# EAGLE design microwave (EAGLE 6.6.0)
AUTHOR: YIFAN HAO; REV: A; TITLE: Microwave_Radar

## Sheet 1 of 3
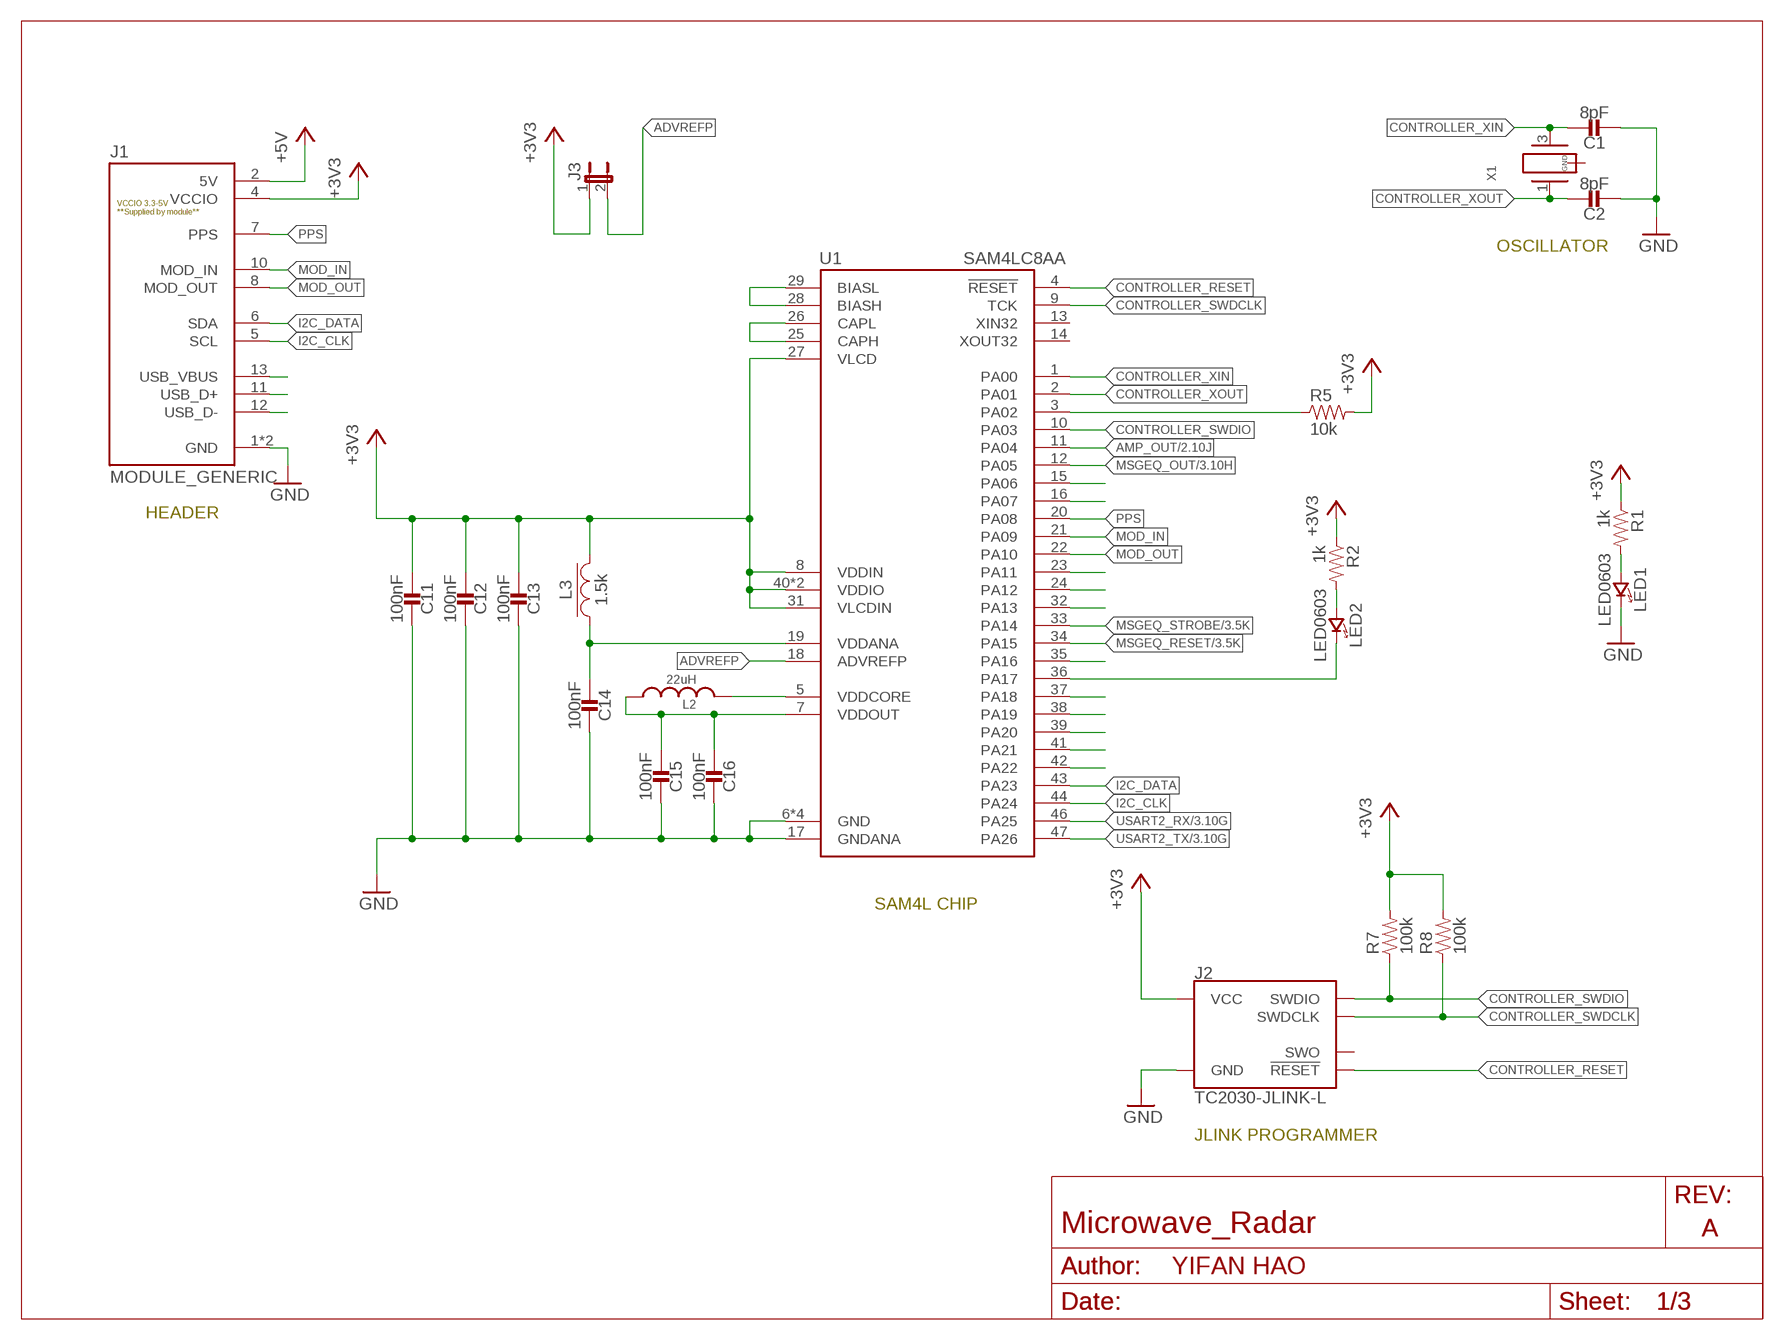
[diagram p0: schematic, sheet 1]
FRAME2 (LETTER_L_BLANK): AUTHOR: Yifan Hao; TITLE: Microwave_Radar

### Parts
C1  8pF  CAPACITOR0402_CAP  [0402_CAP]
C2  8pF  CAPACITOR0402_CAP  [0402_CAP]
C11  100nF  CAPACITOR0402_CAP  [0402_CAP]
C12  100nF  CAPACITOR0402_CAP  [0402_CAP]
C13  100nF  CAPACITOR0402_CAP  [0402_CAP]
C14  100nF  CAPACITOR0402_CAP  [0402_CAP]
C15  100nF  CAPACITOR0402_CAP  [0402_CAP]
C16  100nF  CAPACITOR0402_CAP  [0402_CAP]
J1  MODULE_GENERIC  [MODULE_GENERIC]
J2  TC2030-JLINK-L  [TC2030-IDC]
J3  JUMPER-2PTH  [1X02]
L2  22uH  LHQ3NP  [1212]
L3  1.5k  FERRITE_BEAD0402  [0402_CAP]
LED1  LED0603  [LED-0603]
LED2  LED0603  [LED-0603]
R1  1k  RESISTOR0402_RES  [0402_RES]
R2  1k  RESISTOR0402_RES  [0402_RES]
R5  10k  RESISTOR0402_RES  [0402_RES]
R7  100k  RESISTOR0402_RES  [0402_RES]
R8  100k  RESISTOR0402_RES  [0402_RES]
U1  SAM4LC8AA  [QFN-48-7MM]
X1  FH1600015  [FHXXX]

### Nets
+3V3: C11.2 C12.2 C13.2 J1.4(VCCIO) J2.1(VCC) J3.1 L3.2 R1.1 R2.1 R5.2 R7.2 R8.2 U1.8(VDDIN) U1.27(VLCD) U1.31(VLCDIN) U1.40(VDDIO) U1.45(VDDIO) ; also sheet 2,3
+5V: J1.2(5V) ; also sheet 2,3
ADVREFP: J3.2 U1.18(ADVREFP)
AMP_OUT: U1.11(PA04) ; also sheet 2,3
CONTROLLER_RESET: J2.3(!RESET) U1.4(!RESET)
CONTROLLER_SWDCLK: J2.4(SWDCLK) R8.1 U1.9(TCK)
CONTROLLER_SWDIO: J2.2(SWDIO) R7.1 U1.10(PA03)
CONTROLLER_XIN: C1.1 U1.1(PA00) X1.3
CONTROLLER_XOUT: C2.1 U1.2(PA01) X1.1
GND: C1.2 C2.2 C11.1 C12.1 C13.1 C14.1 C15.1 C16.1 J1.1(GND) J1.14(GND) J2.5(GND) LED1.C(CATHODE) U1.6(GND) U1.17(GNDANA) U1.30(GND) U1.48(GND) U1.THERMAL(GND) ; also sheet 2,3
I2C_CLK: J1.5(SCL) U1.44(PA24)
I2C_DATA: J1.6(SDA) U1.43(PA23)
MOD_IN: J1.10(MOD_IN) U1.21(PA09)
MOD_OUT: J1.8(MOD_OUT) U1.22(PA10)
MSGEQ_OUT: U1.12(PA05) ; also sheet 3
MSGEQ_RESET: U1.34(PA15) ; also sheet 3
MSGEQ_STROBE: U1.33(PA14) ; also sheet 3
N$4: LED1.A(ANODE) R1.2
N$5: L2.P$2 U1.5(VDDCORE)
N$6: C15.2 C16.2 L2.P$1 U1.7(VDDOUT)
N$10: U1.28(BIASH) U1.29(BIASL)
N$11: U1.25(CAPH) U1.26(CAPL)
N$13: C14.2 L3.1 U1.19(VDDANA)
N$14: R5.1 U1.3(PA02)
N$16: U1.15(PA06)
N$21: U1.16(PA07)
N$22: U1.23(PA11)
N$25: U1.24(PA12)
N$26: U1.32(PA13)
N$27: U1.35(PA16)
N$28: J1.13(USB_VBUS)
N$29: U1.37(PA18)
N$30: U1.38(PA19)
N$31: U1.39(PA20)
N$32: U1.41(PA21)
N$33: U1.42(PA22)
N$34: LED2.A(ANODE) R2.2
N$35: LED2.C(CATHODE) U1.36(PA17)
PPS: J1.7(PPS) U1.20(PA08)
USART2_RX: U1.46(PA25) ; also sheet 3
USART2_TX: U1.47(PA26) ; also sheet 3
USB+: J1.11(USB_D+)
USB-: J1.12(USB_D-)
Unconnected: J2.6(SWO) U1.13(XIN32) U1.14(XOUT32) X1.2(GND) X1.4(GND)

### Notes on the sheet
- OSCILLATOR
- HEADER
- SAM4L CHIP
- JLINK PROGRAMMER

## Sheet 2 of 3
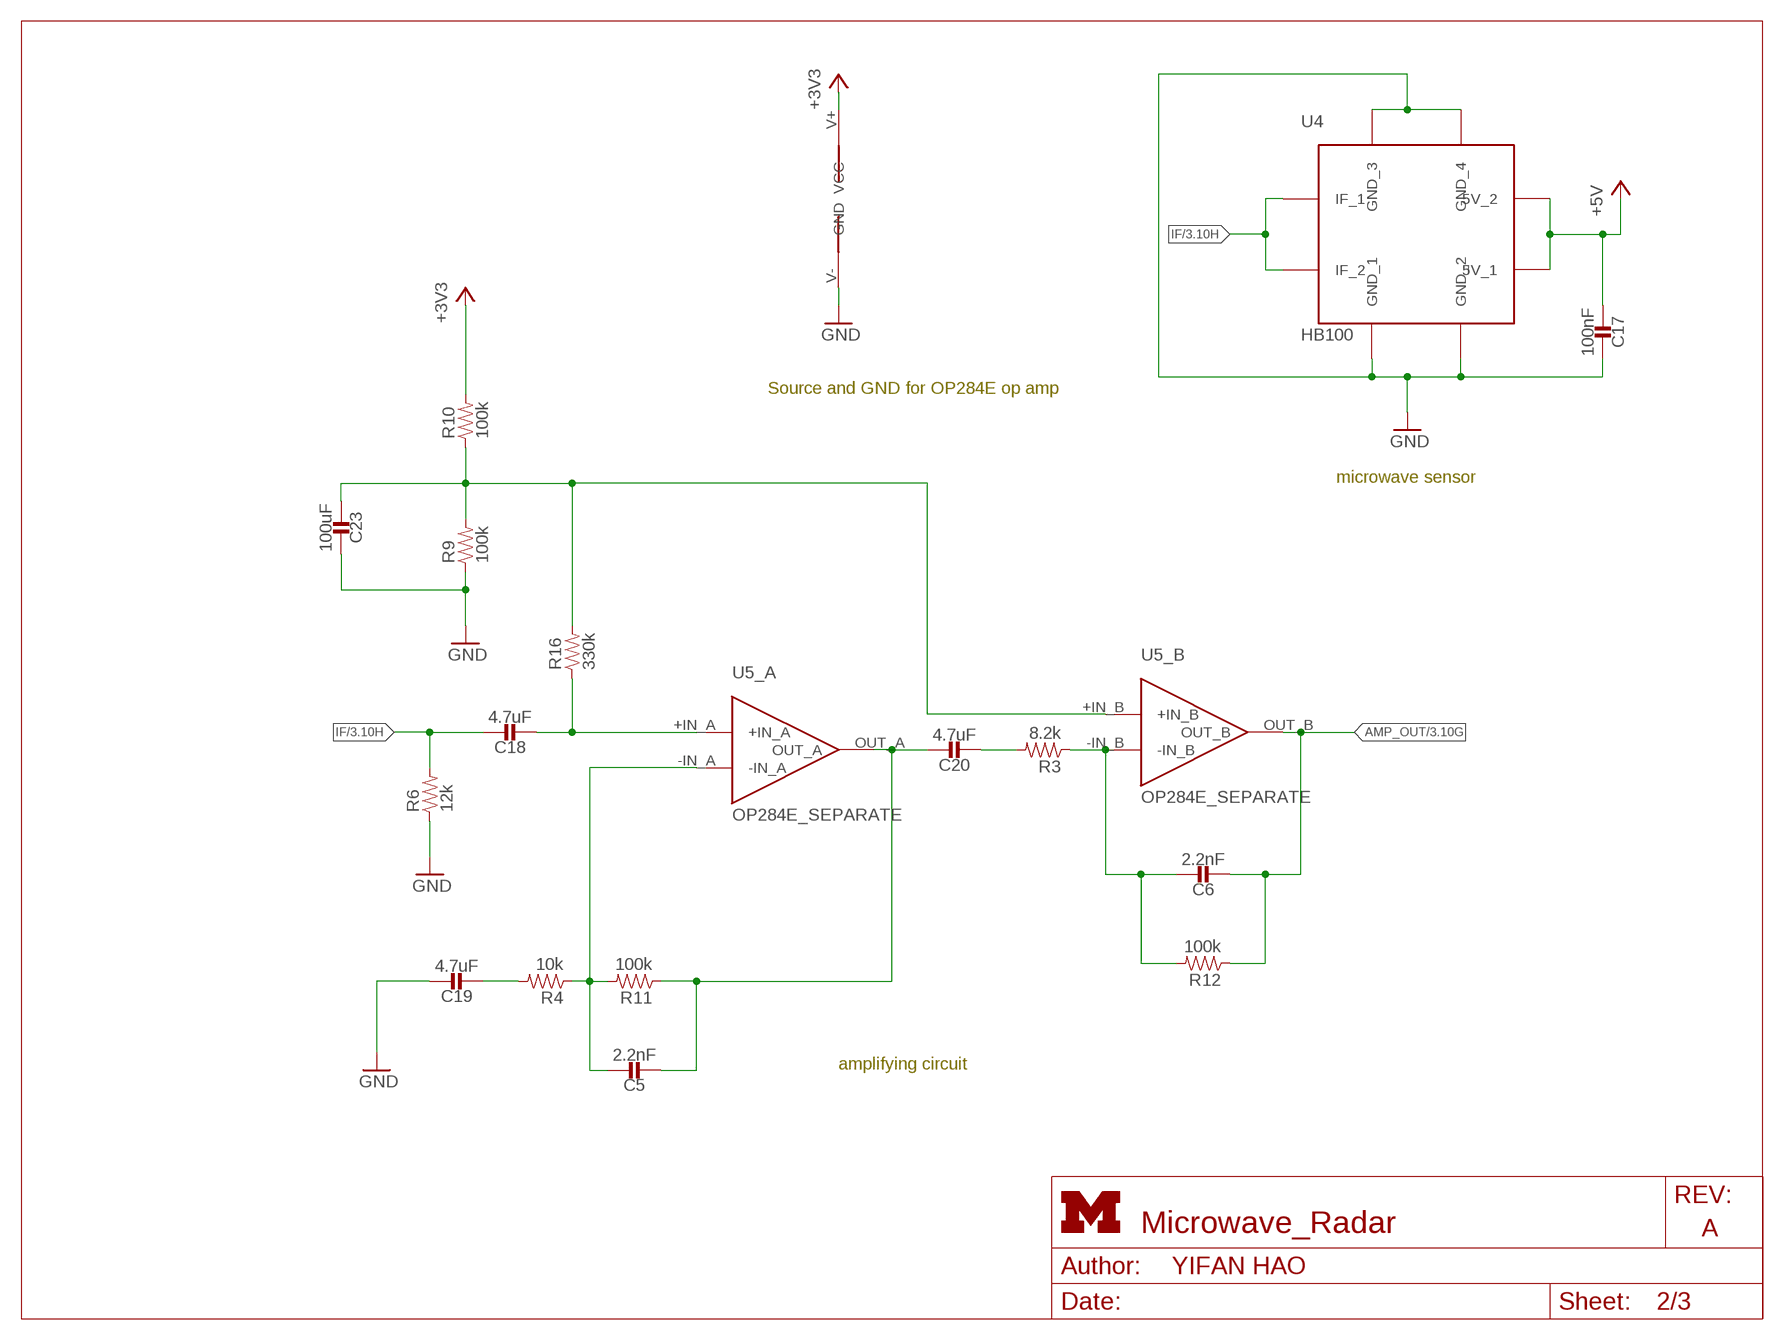
[diagram p1: schematic, sheet 2]
FRAME3 (LETTER_L_UMICH): HEIGHT: 8.5in; WIDTH: 11in

### Parts
C5  2.2nF  CAPACITOR0402_CAP  [0402_CAP]
C6  2.2nF  CAPACITOR0402_CAP  [0402_CAP]
C17  100nF  CAPACITOR0402_CAP  [0402_CAP]
C18  4.7uF  CAPACITOR0402_CAP  [0402_CAP]
C19  4.7uF  CAPACITOR0402_CAP  [0402_CAP]
C20  4.7uF  CAPACITOR0402_CAP  [0402_CAP]
C23  100uF  CAPACITOR1210_CAP  [1210_CAP]
R3  8.2k  RESISTOR0402_RES  [0402_RES]
R4  10k  RESISTOR0402_RES  [0402_RES]
R6  12k  RESISTOR0402_RES  [0402_RES]
R9  100k  RESISTOR0402_RES  [0402_RES]
R10  100k  RESISTOR0402_RES  [0402_RES]
R11  100k  RESISTOR0402_RES  [0402_RES]
R12  100k  RESISTOR0402_RES  [0402_RES]
R16  330k  RESISTOR0402_RES  [0402_RES]
U4  HB100  [HB100]
U5  OP284E_SEPARATE  [OP284E_SEPARATE]

### Nets
+3V3: R10.2 U5.V+(VCC) ; also sheet 1,3
+5V: C17.2 U4.5V_1 U4.5V_2 ; also sheet 1,3
AMP_OUT: C6.2 R12.1 U5.OUT_B(_B:OUT_B) ; also sheet 1,3
GND: C17.1 C19.1 C23.1 R6.1 R9.1 U4.GND_1 U4.GND_2 U4.GND_3 U4.GND_4 U5.V-(GND) ; also sheet 1,3
IF: C18.1 R6.2 U4.IF_1 U4.IF_2 ; also sheet 3
N$1: C23.2 R9.2 R10.1 R16.2 U5.+IN_B(_B:+IN_B)
N$9: C18.2 R16.1 U5.+IN_A(_A:+IN_A)
N$12: C5.1 R4.1 R11.2 U5.-IN_A(_A:-IN_A)
N$15: C19.2 R4.2
N$17: C5.2 C20.1 R11.1 U5.OUT_A(_A:OUT_A)
N$18: C20.2 R3.2
N$19: C6.1 R3.1 R12.2 U5.-IN_B(_B:-IN_B)

### Notes on the sheet
- Source and GND for OP284E op amp
- microwave sensor
- amplifying circuit

## Sheet 3 of 3
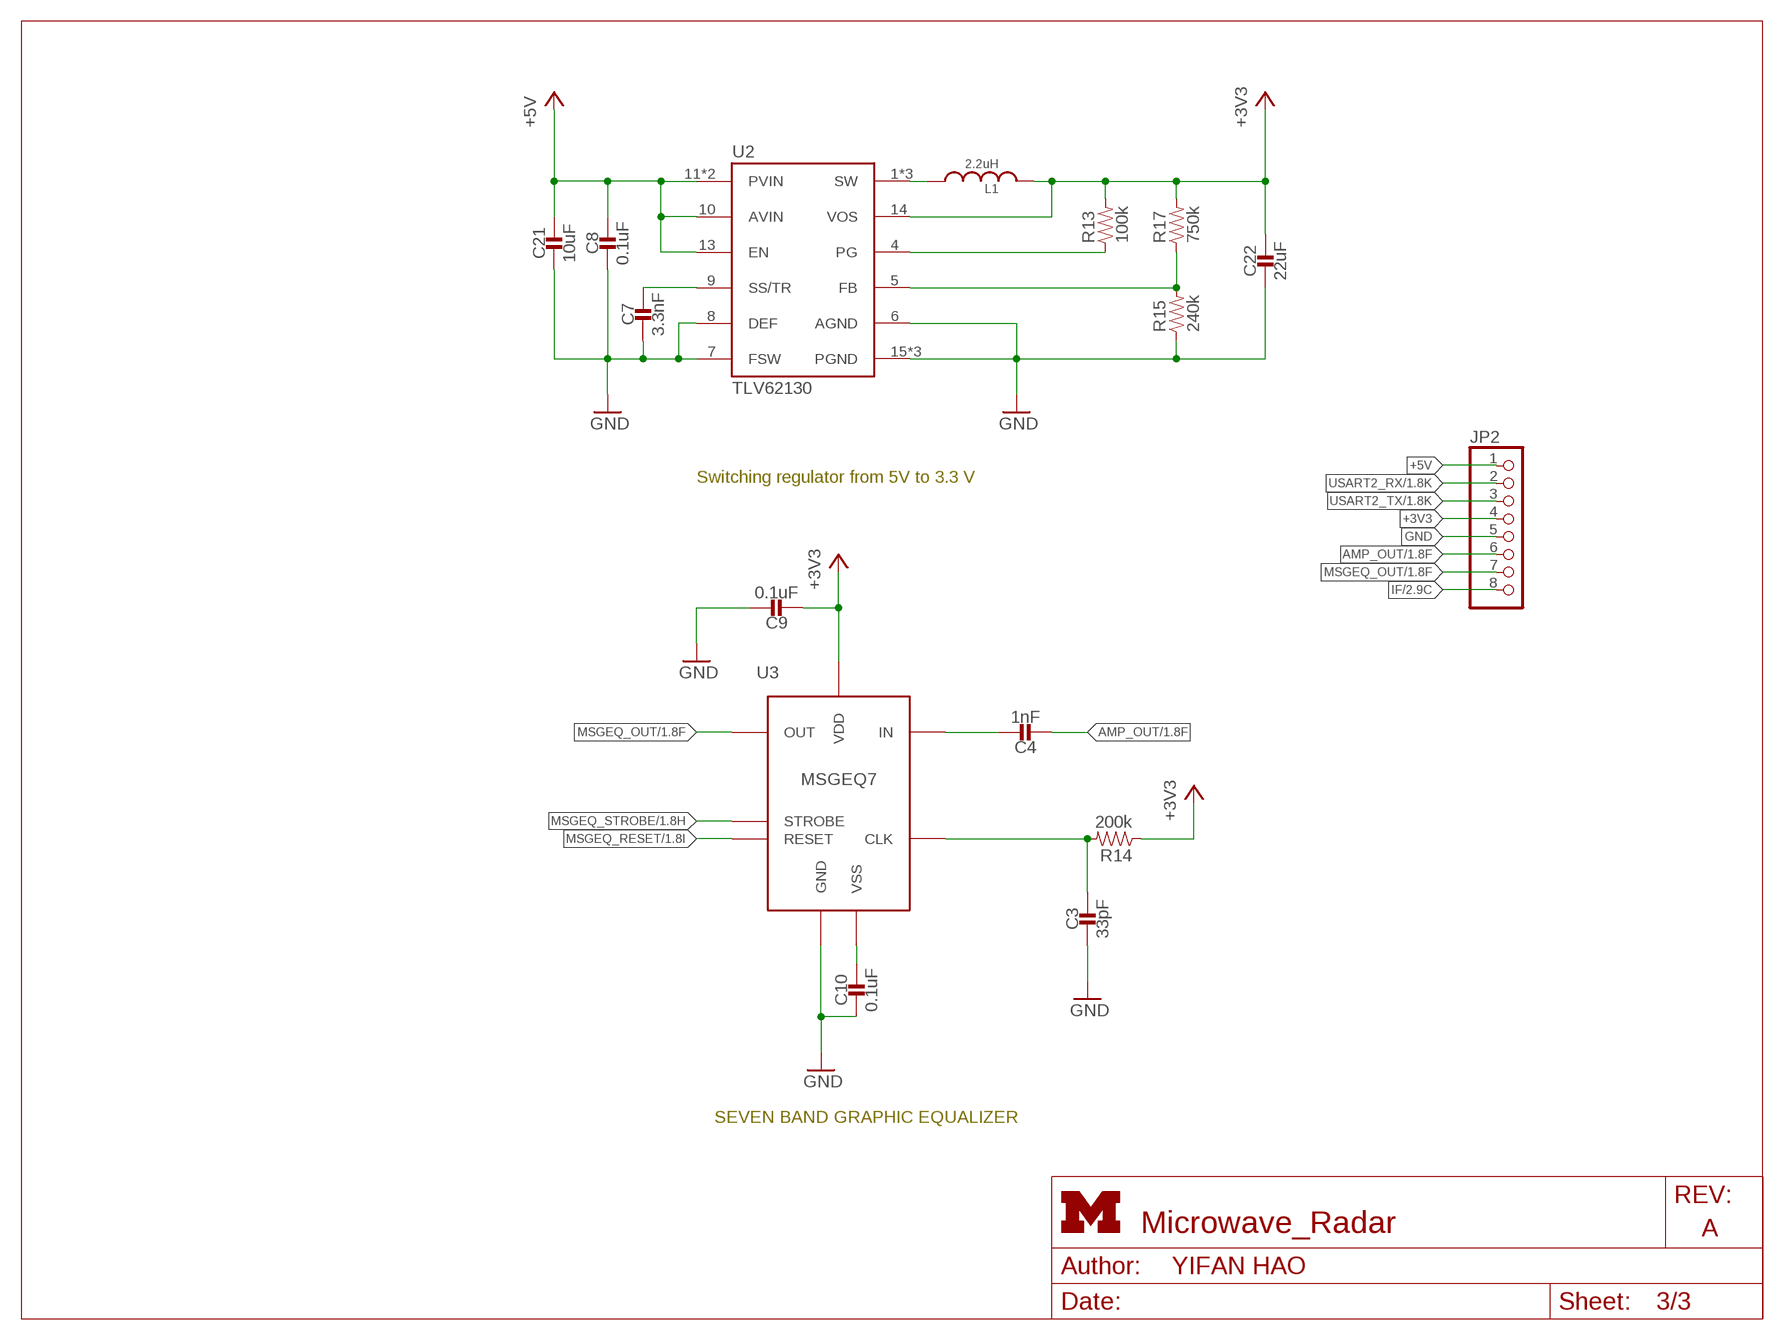
[diagram p2: schematic, sheet 3]
FRAME4 (LETTER_L_UMICH): HEIGHT: 8.5in; WIDTH: 11in

### Parts
C3  33pF  CAPACITOR0603_CAP  [0603_CAP]
C4  1nF  CAPACITOR0603_CAP  [0603_CAP]
C7  3.3nF  CAPACITOR0402_CAP  [0402_CAP]
C8  0.1uF  CAPACITOR0402_CAP  [0402_CAP]
C9  0.1uF  CAPACITOR0603_CAP  [0603_CAP]
C10  0.1uF  CAPACITOR0603_CAP  [0603_CAP]
C21  10uF  CAPACITOR0805_CAP  [0805_CAP]
C22  22uF  CAPACITOR0603_CAP  [0603_CAP]
JP2  PINHD-1X8  [1X08]
L1  2.2uH  INDUCTORIHL  [IHL-1212BZ-11]
R13  100k  RESISTOR0402_RES  [0402_RES]
R14  200k  RESISTOR0603_RES  [0603-RES]
R15  240k  RESISTOR0402_RES  [0402_RES]
R17  750k  RESISTOR0402_RES  [0402_RES]
U2  TLV62130  [TQFN-16/3MM]
U3  MSGEQ7  [DIP-8]

### Nets
+3V3: C9.2 C22.1 JP2.4 L1.P$2 R13.2 R14.1 R17.2 U2.14(VOS) U3.1(VDD) ; also sheet 1,2
+5V: C8.1 C21.P$1 JP2.1 U2.10(AVIN) U2.11(PVIN) U2.12(PVIN) U2.13(EN) ; also sheet 1,2
AMP_OUT: C4.2 JP2.6 ; also sheet 1,2
GND: C3.2 C7.2 C8.2 C9.1 C10.2 C21.P$2 C22.2 JP2.5 R15.1 U2.6(AGND) U2.7(FSW) U2.8(DEF) U2.15(PGND) U2.16(PGND) U2.GND U3.6(GND) ; also sheet 1,2
IF: JP2.8 ; also sheet 2
MSGEQ_OUT: JP2.7 U3.3(OUT) ; also sheet 1
MSGEQ_RESET: U3.7(RESET) ; also sheet 1
MSGEQ_STROBE: U3.4(STROBE) ; also sheet 1
N$2: C3.1 R14.2 U3.8(CLK)
N$3: C4.1 U3.5(IN)
N$7: C10.1 U3.2(VSS)
N$8: C7.1 U2.9(SS/TR)
N$20: L1.P$1 U2.1(SW) U2.2(SW) U2.3(SW)
N$23: R13.1 U2.4(PG)
N$24: R15.2 R17.1 U2.5(FB)
USART2_RX: JP2.2 ; also sheet 1
USART2_TX: JP2.3 ; also sheet 1

### Notes on the sheet
- Switching regulator from 5V to 3.3 V
- SEVEN BAND GRAPHIC EQUALIZER

## Library data of the parts
C1 C2 = passives:CAPACITOR: 0402 Capacitor; DIGIKEY: 490-8230-1-ND
C3 = passives:CAPACITOR: 0402 Capacitor; DIGIKEY: 490-1415-1-ND
C4 = passives:CAPACITOR: 0402 Capacitor; DIGIKEY: 490-1494-1-ND
C5 C6 = passives:CAPACITOR: 0402 Capacitor; DIGIKEY: 490-11418-1-ND
C7 = passives:CAPACITOR: 0402 Capacitor; DIGIKEY: 490-3248-1-ND
C8 = passives:CAPACITOR: 0402 Capacitor; DIGIKEY: 490-5920-1-ND
C9 C10 = passives:CAPACITOR: 0402 Capacitor; DIGIKEY: 490-1532-1-ND
C11-C14 C16 C17 = passives:CAPACITOR: 0402 Capacitor; DIGIKEY: 490-10777-1-ND
C15 = passives:CAPACITOR: 0402 Capacitor; DIGIKEY: 490-13252-1-ND
C18-C20 = passives:CAPACITOR: 0402 Capacitor; DIGIKEY: 1276-1481-1-ND
C21 = passives:CAPACITOR: 0402 Capacitor; DIGIKEY: 490-5523-1-ND
C22 = passives:CAPACITOR: 0402 Capacitor; DIGIKEY: 1276-1193-1-ND
C23 = passives:CAPACITOR: 0402 Capacitor; DIGIKEY: 490-3390-1-ND
J1 = signpost:MODULE_GENERIC: Module header and PCB guildes for signposts; DIGIKEY: S9170-ND
J2 = connector:TC2030-JLINK
J3 = umich:JUMPER-2: Jumper Basic 0.1" spaced jumper. Use with breakaway headers.
JP2 = pinhead:PINHD-1X8: PIN HEADER
L1 = passives:INDUCTOR: A very specific inductor; DIGIKEY: 541-1322-1-ND
L2 = signpost:LHQ3NP: LHQ3NP Inductor; DIGIKEY: 490-5350-1-ND
L3 = passives:FERRITE_BEAD; DIGIKEY: 490-5216-1-ND
LED1 LED2 = leds:LED: LED
R1 R2 = passives:RESISTOR: Resistor Basic schematic elements and footprints for 0603, 1206, and PTH resistors.; DIGIKEY: 1276-3430-1-ND
R3 = passives:RESISTOR: Resistor Basic schematic elements and footprints for 0603, 1206, and PTH resistors.; DIGIKEY: 311-8.20KLRCT-ND
R4 R5 = passives:RESISTOR: Resistor Basic schematic elements and footprints for 0603, 1206, and PTH resistors.; DIGIKEY: 1276-3431-1-ND
R6 = passives:RESISTOR: Resistor Basic schematic elements and footprints for 0603, 1206, and PTH resistors.; DIGIKEY: 1276-4122-1-ND
R7-R12 = passives:RESISTOR: Resistor Basic schematic elements and footprints for 0603, 1206, and PTH resistors.; DIGIKEY: 1276-3432-1-ND
R13 = passives:RESISTOR: Resistor Basic schematic elements and footprints for 0603, 1206, and PTH resistors.; DIGIKEY: P100KJCT-ND
R14 = passives:RESISTOR: Resistor Basic schematic elements and footprints for 0603, 1206, and PTH resistors.; DIGIKEY: RHM200KCFCT-ND
R15 = passives:RESISTOR: Resistor Basic schematic elements and footprints for 0603, 1206, and PTH resistors.; DIGIKEY: P240KLCT-ND
R16 = passives:RESISTOR: Resistor Basic schematic elements and footprints for 0603, 1206, and PTH resistors.; DIGIKEY: 1276-4244-1-ND
R17 = passives:RESISTOR: Resistor Basic schematic elements and footprints for 0603, 1206, and PTH resistors.; DIGIKEY: P750KLCT-ND
U1 = chips:SAM4LC8AA: Atmel SAM4L microcontroller. ARM Cortex M4 with 512 KB Flash and 64 KB RAM; DIGIKEY: ATSAM4LC8AA-MU-ND
U2 = chips:TLV62130: High Efficient 3A switching step-down regulator. 1V-5V out, 4V-17V in.; DIGIKEY: 296-35978-1-ND
U3 = chips:MSGEQ7: A CMOS spectrum analyzer; DIGIKEY: 1568-1335-ND
U4 = microwave_radar:HB100; DIGIKEY: SAM1067-02-ND
U5 = microwave_radar:OP284E_SEPARATE; DIGIKEY: OP284ESZ-ND
X1 = crystals:FH1600015: Pericom Type FH 16 MHz 2.5 x 2.0 mm; DIGIKEY: FH1600015CT-ND

## Board
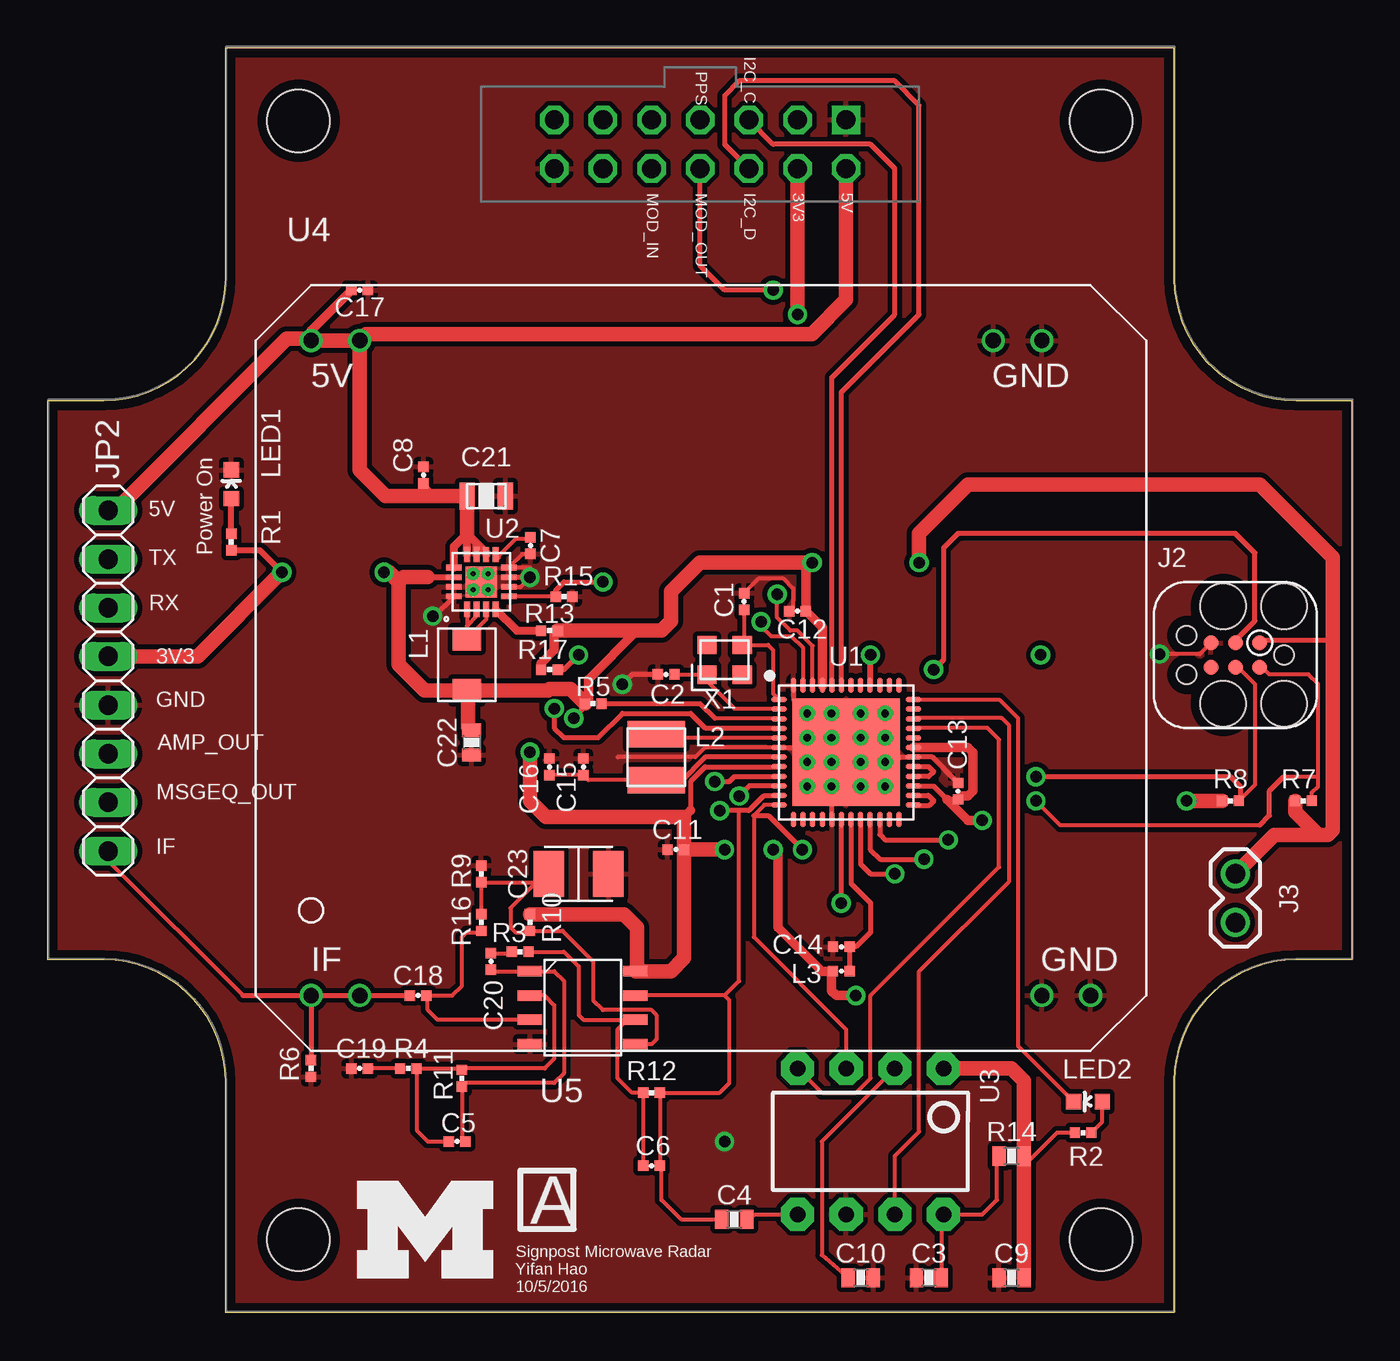
[diagram p3: board, top side]
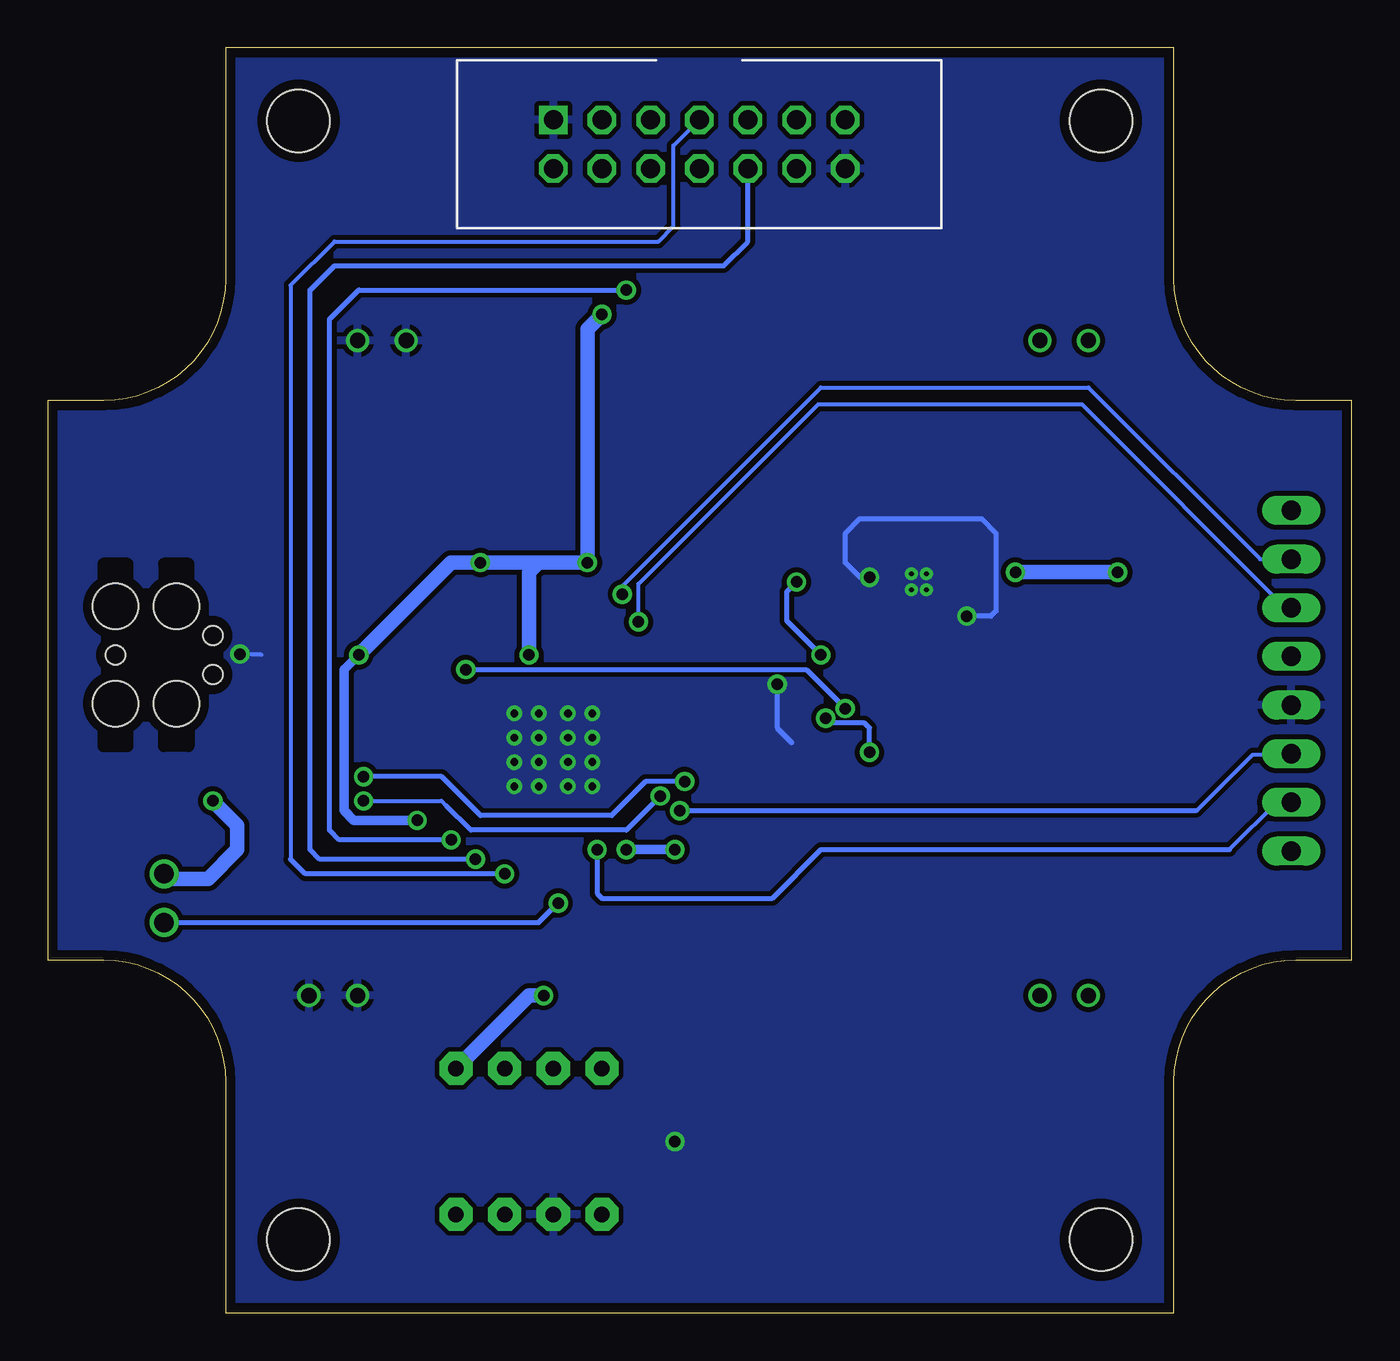
[diagram p4: board, bottom side, seen from below]

Size 68.07 x 66.04 mm. Coordinates in mm from the lower left corner, seen from the top.
Outline: 9.27,0 9.27,12.06 arc90 2.92,18.41 0,18.41 0,47.62 2.92,47.62 arc90 9.27,53.97 9.27,66.04 58.8,66.04 58.8,53.97 arc90 65.15,47.62 68.07,47.62 68.07,18.41 65.15,18.41 arc90 58.8,12.06 58.8,0 9.27,0
Copper layers (1*16): Top 0.0178mm / dielectric 59mil / Bottom 0.0178mm
Design rules "quickturn_co_kr_1oz": minimum track width 4mil, minimum drill 0.200659375mm, track to track 4mil, track to pad 4mil, pad to pad 4mil, via to via 4mil, smd to smd 4mil, copper to edge 20mil, drill to drill 16mil, minimum pad ring 8mil, minimum via ring 8mil, stop-mask expansion 3mil, vias tented up to drill 50mil, thermal gap 10mil
Holes 3.26 mm at 13.08,62.23 54.99,62.23 13.08,3.81 54.99,3.81

### Footprints (pad centres in the part's own frame; a part is rotated, then mirrored left to right if it is on the bottom)
0402_CAP = smd 0.536 x 0.546: 1 -0.433,0; 2 0.433,0
0603_CAP = smd 0.7 x 1: 1 -0.65,0; 2 0.65,0
0805_CAP = smd 0.8 x 1.4: P$1 1,0; P$2 -1,0
1210_CAP = smd 2.4 x 1.6: 1 0,1.55; 2 0,-1.55
MODULE_GENERIC = drill 0.991 square: 1 7.62,29.21 | drill 0.991 octagon: 2 7.62,26.67; 3 5.08,29.21; 4 5.08,26.67; 5 2.54,29.21; 6 2.54,26.67; 7 0,29.21; 8 0,26.67; 9 -2.54,29.21; 10 -2.54,26.67; 11 -5.08,29.21; 12 -5.08,26.67; 13 -7.62,29.21; 14 -7.62,26.67
TC2030-IDC = smd 0.787 x 0.787: 1 -1.27,-0.635; 2 -1.27,0.635; 3 0,-0.635; 4 0,0.635; 5 1.27,-0.635; 6 1.27,0.635 | hole 2.375: -2.54,2.54; 0.635,2.54; 0.635,-2.54; -2.54,-2.54 | hole 1.016: -2.54,0; 2.54,1.016; 2.54,-1.016
1X02 = drill 1.016: 1 0,0; 2 2.54,0
1X08 = drill 1.016 long: 1 -8.89,0; 2 -6.35,0; 3 -3.81,0; 4 -1.27,0; 5 1.27,0; 6 3.81,0; 7 6.35,0; 8 8.89,0
IHL-1212BZ-11 = smd 1.2 x 1.5: P$1 -1.35,0; P$2 1.35,0
1212 = smd 1.4 x 3: P$1 -1.2,0; P$2 1.2,0
LED-0603 = smd 0.8 x 0.8: A 0,-0.75; C 0,0.75
0402_RES = smd 0.536 x 0.546: 1 -0.433,0; 2 0.433,0
0603-RES = smd 0.7 x 1: 1 -0.65,0; 2 0.65,0
QFN-48-7MM = smd 0.8 x 0.28: 1 -3.5,2.75; 2 -3.5,2.25; 3 -3.5,1.75; 4 -3.5,1.25; 5 -3.5,0.75; 6 -3.5,0.25; 7 -3.5,-0.25; 8 -3.5,-0.75; 9 -3.5,-1.25; 10 -3.5,-1.75; 11 -3.5,-2.25; 12 -3.5,-2.75; 25 3.5,-2.75; 26 3.5,-2.25; 27 3.5,-1.75; 28 3.5,-1.25; 29 3.5,-0.75; 30 3.5,-0.25; 31 3.5,0.25; 32 3.5,0.75; 33 3.5,1.25; 34 3.5,1.75; 35 3.5,2.25; 36 3.5,2.75 | smd 0.28 x 0.8: 13 -2.75,-3.5; 14 -2.25,-3.5; 15 -1.75,-3.5; 16 -1.25,-3.5; 17 -0.75,-3.5; 18 -0.25,-3.5; 19 0.25,-3.5; 20 0.75,-3.5; 21 1.25,-3.5; 22 1.75,-3.5; 23 2.25,-3.5; 24 2.75,-3.5; 37 2.75,3.5; 38 2.25,3.5; 39 1.75,3.5; 40 1.25,3.5; 41 0.75,3.5; 42 0.25,3.5; 43 -0.25,3.5; 44 -0.75,3.5; 45 -1.25,3.5; 46 -1.75,3.5; 47 -2.25,3.5; 48 -2.75,3.5 | smd 5.6 x 5.6: THERMAL 0,0
TQFN-16/3MM = smd 0.3 x 0.8: 1 -0.75,-1.43; 2 -0.25,-1.43; 3 0.25,-1.43; 4 0.75,-1.43; 9 0.75,1.43; 10 0.25,1.43; 11 -0.25,1.43; 12 -0.75,1.43 | smd 0.8 x 0.3: 5 1.43,-0.75; 6 1.43,-0.25; 7 1.43,0.25; 8 1.43,0.75; 13 -1.43,0.75; 14 -1.43,0.25; 15 -1.43,-0.25; 16 -1.43,-0.75 | smd 1.63 x 1.63: GND 0,0
DIP-8 = drill 0.813 pad 1.727 octagon: 1 -3.81,-3.81; 2 -1.27,-3.81; 3 1.27,-3.81; 4 3.81,-3.81; 5 3.81,3.81; 6 1.27,3.81; 7 -1.27,3.81; 8 -3.81,3.81
HB100 = drill 0.8: 5V_1 0,34.2; 5V_2 2.54,34.2; GND_1 35.62,34.2; GND_2 38.16,34.2; GND_3 38.16,0; GND_4 40.7,0; IF_1 0,0; IF_2 2.54,0
OP284E_SEPARATE = smd 1.27 x 0.55: +IN_A 0,2.54; +IN_B 5.5,1.27; -IN_A 0,3.81; -IN_B 5.5,2.54; OUT_A 0,5.08; OUT_B 5.5,3.81; V+ 5.5,5.08; V- 0,1.27
FHXXX = smd 1 x 0.95: 1 -0.925,-0.775; 2 0.925,-0.775; 3 0.925,0.775; 4 -0.925,0.775

### Placement (x,y rotation side)
C1  36.35,37.13 90 top
C2  32.28,33.32 180 top
C3  46,1.83 180 top
C4  35.84,4.88 180 top
C5  21.36,8.94 0 top
C6  31.52,7.67 0 top
C7  25.2,40.06 270 top
C8  19.61,43.74 90 top
C9  50.32,1.83 0 top
C10  42.44,1.83 0 top
C11  32.79,24.18 0 top
C12  39.14,36.63 0 top
C13  47.52,27.23 270 top
C14  41.43,19.1 0 top
C15  27.97,28.5 270 top
C16  26.19,28.5 270 top
C17  16.28,53.39 180 top
C18  19.33,16.56 0 top
C19  16.28,12.75 0 top
C20  23.14,18.34 90 top
C21  22.89,42.65 180 top
C22  22.12,29.77 270 top
C23  27.71,22.91 270 top
J1  34.06,33.07 0 top
J2  62,34.34 180 top
J3  62,22.91 270 top
JP2  3.15,32.99 270 top
L1  21.87,33.83 270 top
L2  31.78,29.01 90 top
L3  41.43,17.83 180 top
LED1  9.58,43.26 0 top
LED2  54.31,11.02 90 top
R1  9.58,40.23 90 top
R2  54.05,9.4 0 top
R3  24.66,18.85 180 top
R4  18.82,12.75 180 top
R5  28.47,31.8 180 top
R6  13.74,12.75 90 top
R7  65.56,26.72 180 top
R8  61.75,26.72 180 top
R9  22.63,22.91 270 top
R10  25.17,20.37 90 top
R11  21.62,12.24 90 top
R12  31.52,11.48 180 top
R13  26.19,35.61 0 top
R14  50.32,8.18 180 top
R15  26.95,37.39 180 top
R16  22.63,20.37 90 top
R17  26.19,33.58 180 top
U1  41.68,29.26 0 top
U2  22.63,38.15 0 top
U3  42.95,8.94 180 top
U4  13.74,16.56 0 top
U5  25.17,12.75 0 top
U$1  [UMICH_SOLID_200MIL]  16.15,1.8 0 top
X1  35.33,34.09 0 top

### Tracks (layer width: path | path; a pad name or v marks a point on that pad's centre or on a via)
+3V3  (via drill 0.6)
  Top 0.203: 22.04,32.31 L1.P$2 | U2.14 | 30.76,17.92 U5.V+ | R2.1 52.69,9.4 50.97,7.67
  Top 0.254: v42.95,34.34 42.93,34.32 | R8.2 61.24,26.65 | 40.92,17.76 L3.2 | U1.8 38.17,28.5 34.32,28.5 33.55,27.74 33.55,26.21 | R7.2 65.12,26.03 | 67.08,35.1 63.4,35.1 J2.1 | 21.95,32.56 L1.P$2 | v27.46,31.04 28.04,31.62 R5.2 | U1.27 45.21,27.48 46.25,27.48 46.94,26.8 C13.2 47.7,26.97 | R13.2 26.44,35.43 | 25.75,33.91 R17.2
  Top 0.305: 19.84,38.4 U2.14 | 42.93,34.32 U1.40 | v12.22,38.66 11.08,39.8 R1.1
  Top 0.406: 27.97,31.88 R5.2 28.22,31.98
  Top 0.508: v39.9,39.17 39.57,38.84 C12.2 40.43,35.77 U1.45 | v42.19,16.56 41.17,16.56 40.92,16.81 40.92,17.76 | L3.2 40.41,17.83 38.13,20.12 38.13,23.93 v37.87,24.18 | 33.55,26.21 33.22,25.88 | v48.79,25.7 48.03,25.7 46.94,26.8 | U1.31 48.04,29.51 48.29,29.26 48.29,27.23 48.03,26.97 47.7,26.97 | 26.44,35.43 26.44,34.59 25.75,33.91 | 30.76,35.61 28.22,33.07 28.22,31.98
  Top 0.762: C11.2 33.22,18.52 32.54,17.83 U5.V+ | R10.2 30.07,20.8 30.76,20.12 30.76,17.92 | v39.9,39.17 34.06,39.17 32.54,37.64 32.54,36.12 32.03,35.61 30.76,35.61 R13.2 | U3.1 50.32,12.75 50.97,12.1 R14.1 50.97,7.67 C9.2 | v35.33,24.18 C11.2 | C11.2 33.22,25.88 26.01,25.88 25.17,26.72 v25.17,29.26 | v39.14,52.12 J1.4 | R7.2 65.12,26.14 66.32,24.94 | v45.49,39.17 45.49,40.69 48.03,43.23 63.27,43.23 67.08,39.42 67.08,35.1 67.08,25.2 66.83,24.94 66.32,24.94 | 66.32,24.94 64.03,24.94 J3.1 | R8.2 v59.46,26.72 | v17.55,38.66 17.81,38.66 18.31,38.15 | 18.31,38.15 18.31,33.83 19.66,32.48 L1.P$2 26.11,32.48 26.19,32.56 27.28,32.56 R5.2 | 19.84,38.4 18.57,38.4 18.31,38.15 | 21.95,32.56 21.95,30.59 C22.1 | JP2.4 7.82,34.26 v12.22,38.66
  Bottom 0.254: v25.17,29.26 25.17,30.53 25.43,30.78 27.2,30.78 v27.46,31.04 | 61.75,22.66 J3.1
  Bottom 0.508: v37.87,24.18 v35.33,24.18 | v48.79,25.7 52.1,25.7 52.6,26.21 52.6,33.58 v51.84,34.34
  Bottom 0.762: 42.44,39.17 v39.9,39.17 39.9,51.36 v39.14,52.12 | 42.44,39.17 42.95,38.66 v42.95,34.34 | U3.1 42.95,16.56 v42.19,16.56 | 42.44,39.17 v45.49,39.17 47.02,39.17 v51.84,34.34 | v12.22,38.66 v17.55,38.66 | v59.46,26.72 58.19,25.45 58.19,24.18 59.72,22.66 61.75,22.66
+5V
  Top 0.254: 16.63,51.1 U4.5V_2
  Top 0.406: U2.12 21.88,40.69 | U2.11 22.38,40.19 | 22.38,40.19 21.88,40.69 | U2.10 22.88,39.69 22.38,40.19 | U2.13 21.2,40.01 21.88,40.69 | C8.1 19.61,43.13 20.09,42.65 | C21.P$1 21.89,41.96 21.88,41.96
  Top 0.508: C17.2 13.74,51.28 U4.5V_1
  Top 0.762: 16.63,51.1 39.9,51.1 41.68,52.88 J1.2 | 21.88,40.69 21.88,41.96 C21.P$1 | JP2.1 3.51,41.88 12.47,50.85 13.65,50.85 U4.5V_1 U4.5V_2 16.28,43.99 17.63,42.65 20.09,42.65 C21.P$1
ADVREFP  (via drill 0.6)
  Top 0.254: v41.43,21.39 U1.18
  Bottom 0.254: J3.2 42.44,20.37 v41.43,21.39
AMP_OUT  (via drill 0.6)
  Top 0.203: 35.33,16.56 36.09,17.32 36.09,26.21 | 38.15,26.97 U1.11 | 35.33,16.56 35.59,16.31 35.59,11.99 35.08,11.48 R12.1 C6.2 32.03,7.6 32.03,5.89 33.05,4.88 C4.2 | 35.33,16.56 U5.OUT_B
  Top 0.254: v35.08,26.21 36.09,26.21 36.6,26.21 37.36,26.97 38.15,26.97
  Bottom 0.203: 8.15,26.21 8.08,26.21 5.16,29.13 3.2,29.13 JP2.6
  Bottom 0.254: v35.08,26.21 8.15,26.21
CONTROLLER_RESET  (via drill 0.6)
  Top 0.254: J2.3 62,35.1 63.02,36.12 63.02,39.67 62,40.69 47.52,40.69 46.76,39.93 46.76,34.09 v46.25,33.58 | v26.44,31.55 26.44,30.53 26.95,30.02 28.73,30.02 30,31.29 33.55,31.29 34.32,30.53 38.16,30.53 U1.4
  Bottom 0.254: v46.25,33.58 28.47,33.58 v26.44,31.55
CONTROLLER_SWDCLK  (via drill 0.6)
  Top 0.203: J2.4 62.13,33.71 63.02,32.82 63.02,27.56 R8.1
  Top 0.254: 62,26.72 R8.1 62.26,26.8 62.26,27.48 61.75,27.99 v51.59,27.99 | v34.82,27.74 35.59,27.74 35.84,27.99 38.16,27.99 U1.9
  Bottom 0.254: 51.33,27.74 v51.59,27.99 47.52,27.99 45.49,25.96 38.63,25.96 36.86,27.74 v34.82,27.74
CONTROLLER_SWDIO  (via drill 0.6)
  Top 0.203: J2.2 63.27,33.58 63.53,33.58 63.78,33.32 65.81,33.32 66.32,32.82 66.32,27.99 | 63.27,25.45 52.86,25.45 v51.59,26.72 | R7.1 65.99,27.15 66.32,27.48 66.32,27.99 | 64.54,27.99 66.32,27.99
  Top 0.254: U1.10 36.63,27.51 v36.09,26.97 | 63.27,25.45 63.78,25.96 63.78,27.23 64.54,27.99 | 66.07,26.8 R7.1
  Bottom 0.203: v51.59,26.72 47.52,26.72 47.27,26.47
  Bottom 0.254: v36.09,26.97 37.87,25.2 46,25.2 47.27,26.47
CONTROLLER_XIN
  Top 0.203: U1.1 37.87,32.32 37.87,34.59 37.6,34.86 X1.3 36.35,34.95 C1.1
CONTROLLER_XOUT
  Top 0.203: C2.1 34.39,33.32 X1.1 34.41,32.98 35.84,31.55 38.15,31.55 U1.2
GND  (via drill 0.25, 0.41, 0.6)
  Top 0.203: U1.30 | U1.6 34.31,29.51 33.81,29.01 29.74,29.01 | U2.6 24.67,37.9 v25.17,38.4 | U2.7 24.66,38.4 25.17,38.91 24.07,38.91 U2.8 24.78,39.62 C7.2 | J2.5 60.15,34.39 v58.04,34.39 | 38.76,36.68 C12.1 38.91,36.83 38.91,37.82 38.38,38.35 37.13,38.35 C1.2
  Top 0.254: U1.17 v40.93,27.47 v40.92,27.48 | U1.48 38.93,32.01 v39.65,31.29 | C2.2 30.51,33.32 v30,32.82 | U2.7 v25.17,38.4 | v20.09,36.37 20.17,36.37 U2.16 | v40.92,28.75 41.17,28.75 U1.THERMAL | v43.71,28.75 44.22,28.75 44.48,29.01 U1.30 46.17,29.01 C13.1 | U1.6 38.89,29.51 39.14,29.26 | v39.65,28.75 v39.65,27.48
  Bottom 0.203: v58.04,34.39 56.97,34.39 56.92,34.34
  Bottom 0.254: v30,32.82 30,30.53 29.24,29.77 | v25.17,38.4 25.68,38.4 26.44,39.17 26.44,40.69 25.68,41.45 19.33,41.45 18.57,40.69 18.57,36.63 18.82,36.37 v20.09,36.37
  other vias: 39.65,30.02 40.92,31.29 40.92,30.02 42.44,31.29 43.71,31.29 42.44,30.02 43.71,30.02 43.71,27.48 42.44,27.48 42.44,28.75 22.2,37.74 22.2,38.58 22.99,38.58 22.99,37.74 35.33,8.94
  pour Top (isolate 0.254): -4.04,71.17 -4.04,-7.57 74.7,-7.57 74.7,72.44 -4.04,72.44
  pour Bottom (isolate 0.254): -7.85,73.71 -7.85,-10.11 78.51,-10.11 78.51,74.98 -7.85,74.98
I2C_CLK
  Top 0.254: U1.44 40.93,48.83 44.22,52.12 44.22,59.74 42.95,61.01 37.87,61.01 J1.5
I2C_DATA
  Top 0.254: U1.43 41.43,48.06 45.49,52.12 45.49,63.04 44.22,64.31 36.09,64.31 35.33,63.55 35.33,61.01 J1.6
IF
  Top 0.203: JP2.8 3.15,23.6 10.19,16.56
  Top 0.254: 10.19,16.56 U4.IF_1 | U4.IF_1 R6.2 | U4.IF_1 U4.IF_2 C18.1
MOD_IN  (via drill 0.6)
  Top 0.254: U1.21 42.93,24.2 43.46,23.67 v45.75,23.67
  Bottom 0.254: v45.75,23.67 53.87,23.67 54.38,24.18 54.38,53.39 53.11,54.66 32.79,54.66 31.52,55.93 J1.10
MOD_OUT  (via drill 0.6)
  Top 0.254: U1.22 43.43,24.97 43.71,24.69 v47.02,24.69 | v37.87,53.39 35.33,53.39 34.06,54.66 J1.8
  Bottom 0.254: v47.02,24.69 52.86,24.69 53.37,25.2 53.37,51.87 51.84,53.39 v37.87,53.39
MSGEQ_OUT  (via drill 0.6)
  Top 0.203: U1.12 37.41,26.51 36.86,25.96 36.86,19.61 41.68,14.78 U3.3
  Top 0.254: 36.86,25.96 37.62,25.96 v39.4,24.18
  Bottom 0.203: JP2.7 3.91,26.64 6.38,24.18
  Bottom 0.254: v39.4,24.18 39.4,21.89 39.14,21.64 30.25,21.64 27.71,24.18 6.38,24.18
MSGEQ_RESET
  Top 0.203: U3.7 44.22,8.18 45.49,9.45 45.49,17.83 50.19,22.53 50.19,30.66 49.81,31.04 45.21,31.04 U1.34
MSGEQ_STROBE
  Top 0.203: U3.4 40.41,11.48 42.19,11.48 42.95,12.24 42.95,16.56 49.66,23.27 49.66,29.92 49.05,30.53 45.2,30.53 U1.33
N$1
  Top 0.203: R16.2 R9.2 25.73,22.48 C23.2 25.93,22.91 24.16,21.13 24.16,20.12 24.41,19.86 25.1,19.86 R10.1 26.87,19.94 28.47,18.34 28.47,16.31 28.98,15.8 31.52,15.8 31.78,15.54 31.78,14.27 31.52,14.02 U5.+IN_B
N$2
  Top 0.203: R14.2 49.56,8.09 49.56,5.89 48.79,5.13 U3.8 46.85,5.04 46.65,4.84 C3.1
N$3
  Top 0.203: C4.1 36.94,5.13 U3.5
N$4
  Top 0.305: R1.2 LED1.A
N$5
  Top 0.203: U1.5 32.55,30.01 32.54,30.02 31.96,30.02 L2.P$2
N$6
  Top 0.203: U1.7 | L2.P$1 28.22,27.81 C15.2 C16.2
  Top 0.254: U1.7 34.32,29.01 33.05,27.74 31.85,27.74 L2.P$1
N$7
  Top 0.203: U3.2 40.41,8.94 40.41,3.01 C10.1
N$8
  Top 0.203: U2.9 23.54,39.42 23.54,39.52 24.43,40.41 25.12,40.41 C7.1
N$9
  Top 0.203: R16.1 22.56,19.86 21.87,19.86 21.62,19.61 21.62,17.07 21.11,16.56 C18.2 19.84,16.49 19.84,15.8 20.35,15.29 U5.+IN_A
N$10
  Top 0.254: U1.29 45.99,28.51 46.25,28.24 46,27.99 45.2,27.99 U1.28
N$11
  Top 0.254: U1.26 45.96,27.01 46.25,26.72 46,26.47 45.23,26.47 U1.25
N$12
  Top 0.203: C5.1 19.84,8.94 19.25,9.52 R4.1 21.54,12.75 R11.2 21.69,12.75 25.93,12.75 26.44,13.26 26.44,16.05 25.93,16.56 U5.-IN_A
N$13
  Top 0.254: U1.19 41.93,22.41 42.95,21.39 42.95,19.86 42.19,19.1 C14.2 L3.1
N$14
  Top 0.203: 34.82,31.04 38.15,31.04 U1.3
  Top 0.254: R5.1 34.06,31.8 34.82,31.04
N$15
  Top 0.203: R4.2 C19.2
N$17
  Top 0.203: C5.2 21.62,9.12 R11.1 21.79,11.99 26.44,11.99 26.95,12.5 26.95,17.32 26.44,17.83 U5.OUT_A 23.21,17.83 C20.1
N$18
  Top 0.203: C20.2 24.16,18.77 R3.2
N$19
  Top 0.203: R3.1 26.95,18.85 27.71,18.08 27.71,15.54 27.97,15.29 30.25,15.29 | C6.1 R12.2 30.51,11.48 29.74,12.24 29.74,14.78 30.25,15.29 | U5.-IN_B 30.25,15.29
N$20
  Top 0.203: U2.1 21.88,35.86 | 21.88,35.86 21.88,35.19 L1.P$1 22.88,36.19 U2.3 | U2.2 22.38,36.36 21.88,35.86
N$23
  Top 0.406: U2.4 24.49,35.61 R13.1
N$24  (via drill 0.6)
  Top 0.203: 24.15,37.31 U2.5 24.07,37.39 R15.2
  Top 0.254: R15.2 26.52,37.72 26.95,38.15 v28.98,38.15 | R17.1 26.95,33.58 v27.71,34.34
  Bottom 0.254: v28.98,38.15 29.49,37.64 29.49,36.12 v27.71,34.34
N$34
  Top 0.203: R2.2 55.06,9.97 LED2.A
N$35
  Top 0.203: U1.36 49.68,32.01 50.65,31.04 50.65,13.93 LED2.C 53.31,11.26
PPS  (via drill 0.6)
  Top 0.254: U1.20 42.43,23.43 42.95,22.91 v44.22,22.91
  Bottom 0.203: 55.4,23.67 55.4,53.64 53.11,55.93 36.2,55.93 35.41,56.72 35.41,60.93 J1.7
  Bottom 0.254: v44.22,22.91 54.64,22.91 55.4,23.67
USART2_RX  (via drill 0.6)
  Top 0.203: U1.46 39.93,34.82 39.14,35.61 38.76,35.61 38.07,36.3 v38.07,37.52
  Bottom 0.203: v38.07,37.52 38.07,37.95 27.71,48.31 13.74,48.31 4.78,39.34 JP2.2
USART2_TX  (via drill 0.6)
  Top 0.203: U1.47 39.45,32.78 39.45,34.7 38.84,35.31 37.77,35.31 37.24,35.84 v37.24,36.07
  Bottom 0.203: v37.24,36.07 37.24,38.05 27.98,47.31 27.86,47.42 14.07,47.42 3.45,36.8 JP2.3

### Text on the board
tPlace: I2C_C | PPS | MOD_IN | MOD_OUT | I2C_D | 3V3 | 5V | 5V | TX | Power On | RX | 3V3 | GND | AMP_OUT | MSGEQ_OUT | IF | A | Signpost Microwave Radar / Yifan Hao / 10/5/2016